# Altium schematic sheet [1] Cube_Sensor.SchDoc
size A4
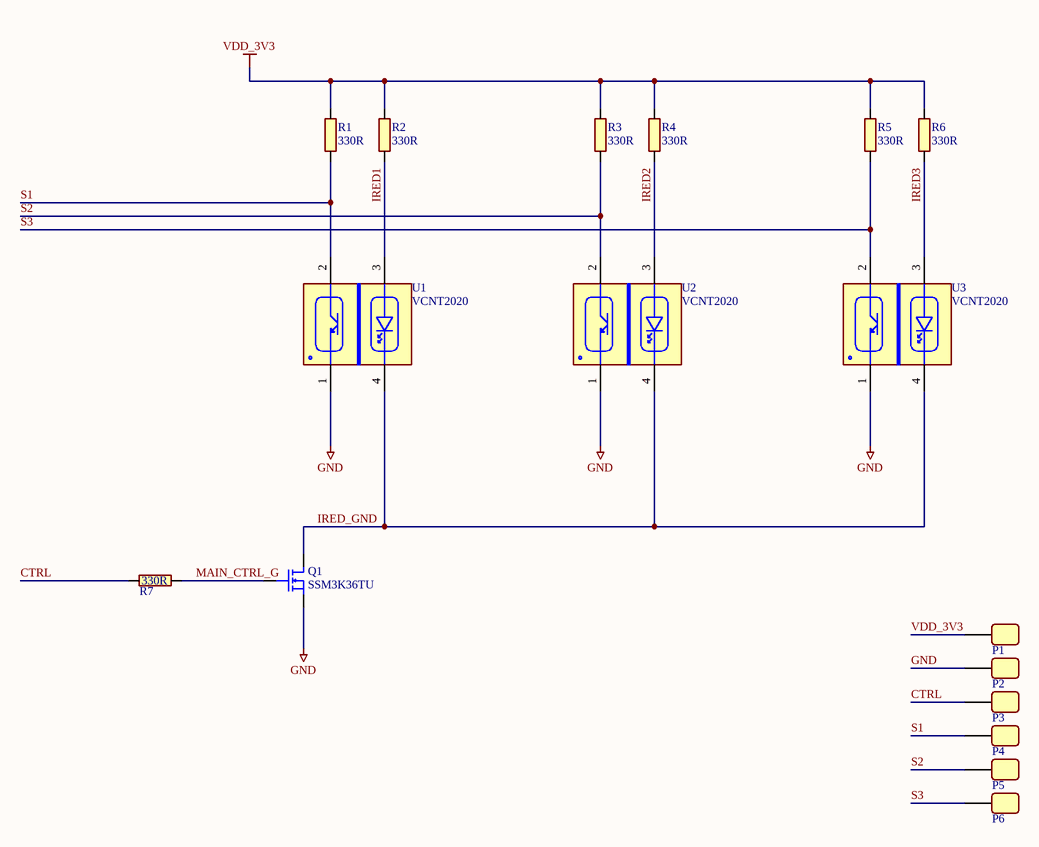
[diagram p0: [1] Cube_Sensor.SchDoc]

## Parts
P1  PAD_4  [PAD_B2B]  (value not drawn)  (no BOM)
P2  PAD_4  [PAD_B2B]  (value not drawn)  (no BOM)
P3  PAD_4  [PAD_B2B]  (value not drawn)  (no BOM)
P4  PAD_4  [PAD_B2B]  (value not drawn)  (no BOM)
P5  PAD_4  [PAD_B2B]  (value not drawn)  (no BOM)
P6  PAD_4  [PAD_B2B]  (value not drawn)  (no BOM)
Q1  SSM3K36TU  [SSM3K36TU]
R1  330R  [RESC0402X04N]
R2  330R  [RESC0402X04N]
R3  330R  [RESC0402X04N]
R4  330R  [RESC0402X04N]
R5  330R  [RESC0402X04N]
R6  330R  [RESC0402X04N]
R7  330R  [RESC0402X04N]
U1  VCNT2020  [VCNT2020]
U2  VCNT2020  [VCNT2020]
U3  VCNT2020  [VCNT2020]

## Nets
GND: P2.1 Q1.2 U1.1 U2.1 U3.1
VDD_3V3: P1.1 R1.2 R2.2 R3.2 R4.2 R5.2 R6.2
CTRL: P3.1 R7.2
IRED1: R2.1 U1.3
IRED2: R4.1 U2.3
IRED3: R6.1 U3.3
IRED_GND: Q1.3 U1.4 U2.4 U3.4
MAIN_CTRL_G: Q1.1 R7.1
S1: P4.1 R1.1 U1.2
S2: P5.1 R3.1 U2.2
S3: P6.1 R5.1 U3.2

## Library data of the parts
P1-P6 = PAD_4: a Pad for board to board connection
Q1 = SSM3K36TU: N-Channel 20V 500mA (Ta) 800mW (Ta) Surface Mount UFM; Manufacturer: Toshiba Semiconductor and Storage; Categories: Transistors; Case: UFM; Manufacturer Part Number: SSM3K36TU; Supplier 1: SSM3K36TULFCT-ND; Supplier Part Number 1: Digi-Key
R1-R7 = RES 330R: RES SMD 330R OHM 1% 1/16W 0402; Manufacturer: YAGEO; Manufacturer Part Number: RC0402FR-07330RL; Category: Resistors; Package / Case: 0402; Supplier 1: LCSC; Supplier Part Number 1: C105875; Resistance: 330R
U1-U3 = VCNT2020: REFLECTIVE SENSOR WITH PTR OUTPU; Manufacturer: Vishay Semiconductor Opto Division; Categories: Optical Sensors; Case: 4-SMD Module; Manufacturer Part Number: VCNT2020; Supplier 1: Digi-Key; Supplier Part Number 1: VCNT2020CT-ND